# EAGLE design Esp32Relays (EAGLE 9.6.2)
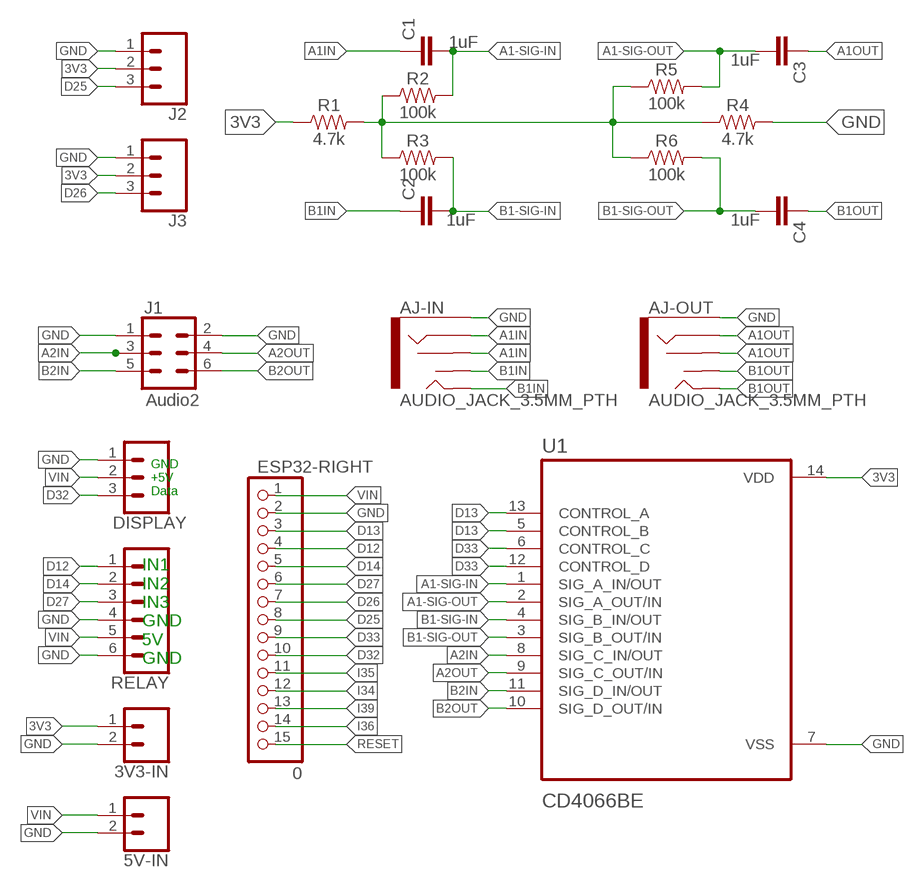
[diagram p0: schematic, sheet 1]

## Parts
3V3-IN  CONN_02  [1X02]
5V-IN  CONN_02  [1X02]
AJ-IN  AUDIO_JACK_3.5MM_PTH  [AUDIO-JACK]
AJ-OUT  AUDIO_JACK_3.5MM_PTH  [AUDIO-JACK]
C1  1uF  2.2UF-0805-25V-(+80/-20%)  [0805]
C2  1uF  2.2UF-0805-25V-(+80/-20%)  [0805]
C3  1uF  2.2UF-0805-25V-(+80/-20%)  [0805]
C4  1uF  2.2UF-0805-25V-(+80/-20%)  [0805]
DISPLAY  CONN_03  [1X03]
ESP32-RIGHT  0  PINHD-1X15  [1X15]
J1  Audio2  CONN_03X2FEMALE  [2X3]
J2  CONN_03  [1X03]
J3  CONN_03  [1X03]
R1  4.7k  0.3OHM-0805-1/8W-1%  [0805]
R2  100k  0.3OHM-0805-1/8W-1%  [0805]
R3  100k  0.3OHM-0805-1/8W-1%  [0805]
R4  4.7k  0.3OHM-0805-1/8W-1%  [0805]
R5  100k  0.3OHM-0805-1/8W-1%  [0805]
R6  100k  0.3OHM-0805-1/8W-1%  [0805]
RELAY  CONN_06NO_SILK_FEMALE_PTH  [1X06_NO_SILK]
U1  CD4066BE  [DIP794W45P254L1969H508Q14]

## Nets
3V3: 3V3-IN.1 J2.2 J3.2 R1.1 U1.14(VDD)
A1-SIG-IN: C1.2 R2.2 U1.1(SIG_A_IN/OUT)
A1-SIG-OUT: C3.2 R5.2 U1.2(SIG_A_OUT/IN)
A1IN: AJ-IN.RING AJ-IN.RSH C1.1
A1OUT: AJ-OUT.RING AJ-OUT.RSH C3.1
A2IN: J1.3 U1.8(SIG_C_IN/OUT)
A2OUT: J1.4 U1.9(SIG_C_OUT/IN)
B1-SIG-IN: C2.2 R3.2 U1.4(SIG_B_IN/OUT)
B1-SIG-OUT: C4.2 R6.2 U1.3(SIG_B_OUT/IN)
B1IN: AJ-IN.TIP AJ-IN.TSH C2.1
B1OUT: AJ-OUT.TIP AJ-OUT.TSH C4.1
B2IN: J1.5 U1.11(SIG_D_IN/OUT)
B2OUT: J1.6 U1.10(SIG_D_OUT/IN)
D12: ESP32-RIGHT.4 RELAY.1
D13: ESP32-RIGHT.3 U1.5(CONTROL_B) U1.13(CONTROL_A)
D14: ESP32-RIGHT.5 RELAY.2
D25: ESP32-RIGHT.8 J2.3
D26: ESP32-RIGHT.7 J3.3
D27: ESP32-RIGHT.6 RELAY.3
D32: DISPLAY.3 ESP32-RIGHT.10
D33: ESP32-RIGHT.9 U1.6(CONTROL_C) U1.12(CONTROL_D)
GND [POWER]: 3V3-IN.2 5V-IN.2 AJ-IN.SLEEVE AJ-OUT.SLEEVE DISPLAY.1 ESP32-RIGHT.2 J1.1 J1.2 J2.1 J3.1 R4.2 RELAY.4 RELAY.6 U1.7(VSS)
I34: ESP32-RIGHT.12
I35: ESP32-RIGHT.11
I36: ESP32-RIGHT.14
I39: ESP32-RIGHT.13
N$2: R1.2 R2.1 R3.1 R4.1 R5.1 R6.1
RESET: ESP32-RIGHT.15
VIN [POWER]: 5V-IN.1 DISPLAY.2 ESP32-RIGHT.1 RELAY.5

## Notes on the sheet
- GND
  +5V
  Data
- IN1
  IN2
  IN3
  GND
  5V
  GND

## Library data of the parts
3V3-IN 5V-IN = SparkFun-Connectors:CONN_02: Multi connection point. Often used as Generic Header-pin footprint for 0.1 inch spaced/style header connections On any of the 0.1 inch spaced packages, you can populate with these: Break Away Headers - Straight <https://www.sparkfun.com/products/116> (PRT-00116) Break Away Male Headers - Right Angle <https://www.sparkfun.com/products/553> (PRT-00553) Female Headers <https://www.sparkfun.com/products/115> (PRT-00115) Break Away Headers - Machine Pin <https://www.sparkfun.com/products/117> (PRT-00117) Break Away Female Headers - Swiss Machine Pin <https://www.sparkfun.com/products/743> (PRT-00743) For SCREWTERMINALS and SPRING TERMINALS visit here: Screw Terimnals on SparkFun.com <https://www.sparkfun.com/search/results?term=Screw+Terminals> (5mm/3.5mm/2.54mm spacing) This device is also useful as a general connection point to wire up your design to another part of your project. Our various solder wires solder well into these plated through hole pads. Hook-Up Wire - Assortment (Stranded, 22 AWG) <https://www.sparkfun.com/products/11375> (PRT-11375) Hook-Up Wire - Assortment (Solid Core, 22 AWG) <https://www.sparkfun.com/products/11367> (PRT-11367) View the entire wire category on our website here <https://www.sparkfun.com/categories/141> Special notes: Molex polarized connector foot print use with: PRT-08233 with associated crimp pins and housings. 2.54_SCREWTERM for use with PRT-10571. 3.5mm Screw Terminal footprints for PRT-08084 5mm Screw Terminal footprints for use with PRT-08432
AJ-IN AJ-OUT = SparkFun-Connectors:AUDIO_JACK_3.5MM: Audio Jack 3.5mm variants of PTH and SMT stereo audio jack with bypass switches. SparkFun Products: SparkFun SparkPunk Sound Kit <[https://www.sparkfun.com/products/11177]> - PTH MP3 Trigger <https://www.sparkfun.com/products/13720> -3.5mm SMD SparkFun PicoBoard <https://www.sparkfun.com/products/11888>- 2.5mm SMD; PROD_ID: CONN-08774; SF_ID: PRT-08032
C1-C4 = SparkFun-Capacitors:2.2UF: 2.2µF ceramic capacitors A capacitor is a passive two-terminal electrical component used to store electrical energy temporarily in an electric field.; PROD_ID: CAP-11624; VALUE: 2.2uF
DISPLAY J2 J3 = SparkFun-Connectors:CONN_03: Multi connection point. Often used as Generic Header-pin footprint for 0.1 inch spaced/style header connections On any of the 0.1 inch spaced packages, you can populate with these: Break Away Headers - Straight <https://www.sparkfun.com/products/116> (PRT-00116) Break Away Male Headers - Right Angle <https://www.sparkfun.com/products/553> (PRT-00553) Female Headers <https://www.sparkfun.com/products/115> (PRT-00115) Break Away Headers - Machine Pin <https://www.sparkfun.com/products/117> (PRT-00117) Break Away Female Headers - Swiss Machine Pin <https://www.sparkfun.com/products/743> (PRT-00743) Stackable Header - 3 Pin (Female, 0.1") <https://www.sparkfun.com/products/13875> (PRT-13875) For SCREWTERMINALS and SPRING TERMINALS visit here: Screw Terimnals on SparkFun.com <https://www.sparkfun.com/search/results?term=Screw+Terminals> (5mm/3.5mm/2.54mm spacing) This device is also useful as a general connection point to wire up your design to another part of your project. Our various solder wires solder well into these plated through hole pads. Hook-Up Wire - Assortment (Stranded, 22 AWG) <https://www.sparkfun.com/products/11375> (PRT-11375) Hook-Up Wire - Assortment (Solid Core, 22 AWG) <https://www.sparkfun.com/products/11367> (PRT-11367) View the entire wire category on our website here <https://www.sparkfun.com/categories/141> Special notes: Molex polarized connector foot print use with SKU : PRT-08232 with associated crimp pins and housings.
ESP32-RIGHT = pinhead:PINHD-1X15: PIN HEADER
J1 = SparkFun-Connectors:CONN_03X2: Multi connection point. Often used as Generic Header-pin footprint for 0.1 inch spaced/style header connections You can populate with any combo of single row headers, but if you'd like an exact match, check these: Header - 2x3 (Male, 0.1") <https://www.sparkfun.com/products/12807> (PRT-12807) Header - 2x3 (Female, 0.1") <https://www.sparkfun.com/products/13010> (PRT-13010) 2x3 Pin Shrouded Header <https://www.sparkfun.com/products/10877> (PRT-10877) On any of the 0.1 inch spaced packages, you can populate with these: Break Away Headers - Straight <https://www.sparkfun.com/products/116> (PRT-00116) Break Away Male Headers - Right Angle <https://www.sparkfun.com/products/553> (PRT-00553) Female Headers <https://www.sparkfun.com/products/115> (PRT-00115) Break Away Headers - Machine Pin <https://www.sparkfun.com/products/117> (PRT-00117) Break Away Female Headers - Swiss Machine Pin <https://www.sparkfun.com/products/743> (PRT-00743) Special note: the shrouded connector mates well with our 3x2 ribbon cables: Ribbon Crimp Connector - 6-pin (2x3, Female) <https://www.sparkfun.com/products/10651> (PRT-10651) Ribbon Cable - 6 wire (15ft) <https://www.sparkfun.com/products/10646> (PRT-10646); PROD_ID: CONN-11566; VALUE: FEMALE 2x3
R1-R6 = SparkFun-Resistors:0.3OHM: 0.3Ω resistor A resistor is a passive two-terminal electrical component that implements electrical resistance as a circuit element. Resistors act to reduce current flow, and, at the same time, act to lower voltage levels within circuits. - Wikipedia; PROD_ID: RES-11622; VALUE: 0.3
RELAY = SparkFun-Connectors:CONN_06: Multi connection point. Often used as Generic Header-pin footprint for 0.1 inch spaced/style header connections On any of the 0.1 inch spaced packages, you can populate with these: Break Away Headers - Straight <https://www.sparkfun.com/products/116> (PRT-00116) Break Away Male Headers - Right Angle <https://www.sparkfun.com/products/553> (PRT-00553) Female Headers <https://www.sparkfun.com/products/115> (PRT-00115) Break Away Headers - Machine Pin <https://www.sparkfun.com/products/117> (PRT-00117) Break Away Female Headers - Swiss Machine Pin <https://www.sparkfun.com/products/743> (PRT-00743) Arduino Stackable Header - 6 Pin <https://www.sparkfun.com/products/9280> (PRT-09280) For SCREWTERMINALS and SPRING TERMINALS visit here: Screw Terimnals on SparkFun.com <https://www.sparkfun.com/search/results?term=Screw+Terminals> (5mm/3.5mm/2.54mm spacing) This device is also useful as a general connection point to wire up your design to another part of your project. Our various solder wires solder well into these plated through hole pads. Hook-Up Wire - Assortment (Stranded, 22 AWG) <https://www.sparkfun.com/products/11375> (PRT-11375) Hook-Up Wire - Assortment (Solid Core, 22 AWG) <https://www.sparkfun.com/products/11367> (PRT-11367) View the entire wire category on our website here <https://www.sparkfun.com/categories/141>; PROD_ID: CONN-08437
U1 = CD4066BE:CD4066BE: Check availability <https://pricing.snapeda.com/parts/CD4066BE/Texas%20Instruments/view-part?ref=eda>; AVAILABILITY: In Stock; DESCRIPTION: 10-pA on-state leakage current, 20-V, 1:1 (SPST), 4-channel analog switch; MF: Texas Instruments; MP: CD4066BE; PACKAGE: PDIP-14 Texas Instruments; PRICE: None; PURCHASE-URL: https://pricing.snapeda.com/search/part/CD4066BE/?ref=eda

## Net classes
1 POWER: width 0.3 mm

## Board
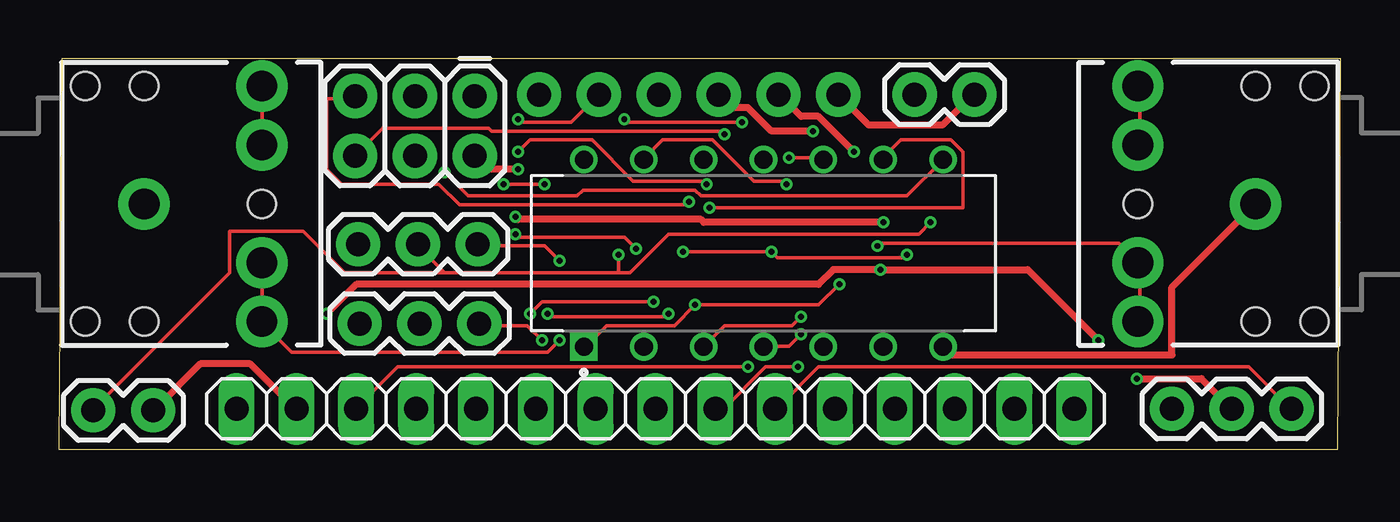
[diagram p1: board, top side]
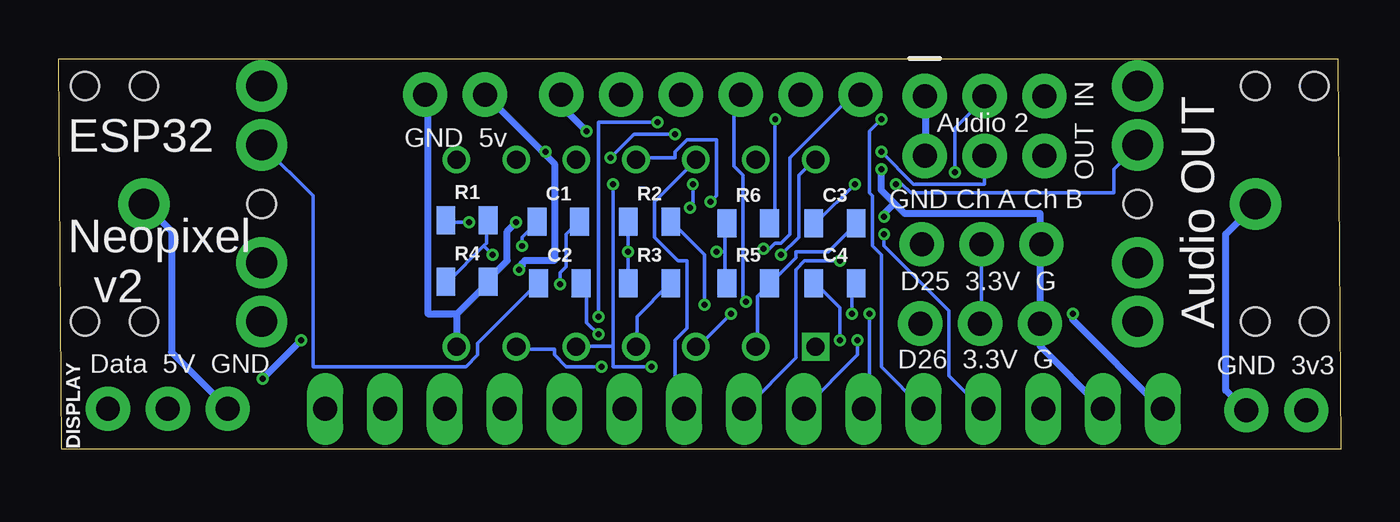
[diagram p2: board, bottom side, seen from below]

Size 54.41 x 16.56 mm. Coordinates in mm from the lower left corner, seen from the top.
Outline: 0,0 54.28,0 54.41,16.56 0.13,16.56 0,0
Copper layers (1*16): Top 0.035559375mm / dielectric 1.6mm / Bottom 0.035559375mm
Design rules "oshpark-2layer": minimum track width 6mil, minimum drill 10mil, track to track 6mil, track to pad 6mil, pad to pad 6mil, via to via 6mil, smd to smd 6mil, copper to edge 15mil, drill to drill 6mil, minimum pad ring 5mil, minimum via ring 5mil, stop-mask expansion 2.5mil, vias tented up to drill 0mil, thermal gap 10mil

### Footprints (pad centres in the part's own frame; a part is rotated, then mirrored left to right if it is on the bottom)
1X02 = drill 1.016 pad 1.88: 1 0,0; 2 2.54,0
AUDIO-JACK = drill 1.3 pad 2.184: RING 5,5; RSH 5,2.5; SLEEVE 0,0; TIP 5,-5; TSH 5,-2.5 | hole 1.2: 0,5; -2.5,5; -2.5,-5; 0,-5; 5,0
0805 = smd 0.8 x 1.2: 1 -0.9,0; 2 0.9,0
1X03 = drill 1.016 pad 1.88: 1 0,0; 2 2.54,0; 3 5.08,0
1X15 = drill 1.016 long: 1 -17.78,0; 2 -15.24,0; 3 -12.7,0; 4 -10.16,0; 5 -7.62,0; 6 -5.08,0; 7 -2.54,0; 8 0,0; 9 2.54,0; 10 5.08,0; 11 7.62,0; 12 10.16,0; 13 12.7,0; 14 15.24,0; 15 17.78,0
2X3 = drill 1.016 pad 1.88: 1 0,0; 2 0,2.54; 3 2.54,0; 4 2.54,2.54; 5 5.08,0; 6 5.08,2.54
1X06_NO_SILK = drill 1.016 pad 1.88: 1 0,0; 2 2.54,0; 3 5.08,0; 4 7.62,0; 5 10.16,0; 6 12.7,0
DIP794W45P254L1969H508Q14 = drill 0.77 pad 1.17 square: 1 -3.97,7.62 | drill 0.77 pad 1.17: 2 -3.97,5.08; 3 -3.97,2.54; 4 -3.97,0; 5 -3.97,-2.54; 6 -3.97,-5.08; 7 -3.97,-7.62; 8 3.97,-7.62; 9 3.97,-5.08; 10 3.97,-2.54; 11 3.97,0; 12 3.97,2.54; 13 3.97,5.08; 14 3.97,7.62

### Placement (x,y rotation side)
3V3-IN  1.46,1.65 0 top
5V-IN  36.32,15.05 0 top
AJ-IN  50.8,10.41 180 top
AJ-OUT  3.62,10.41 0 top
C1  33.21,9.65 0 bottom
C2  33.15,7.05 0 bottom
C3  21.46,9.59 0 bottom
C4  21.46,7.05 0 bottom
DISPLAY  47.24,1.71 0 top
ESP32-RIGHT  25.32,1.71 0 top
J1  17.65,14.99 180 top
J2  12.7,8.7 0 top
J3  12.76,5.33 0 top
R1  37.08,9.72 0 bottom
R2  29.34,9.65 0 bottom
R3  29.34,7.05 0 bottom
R4  37.08,7.11 0 bottom
R5  25.15,7.05 0 bottom
R6  25.15,9.59 0 bottom
RELAY  20.38,15.05 0 top
U1  29.91,8.32 90 top

### Tracks (layer width: path | path; a pad name or v marks a point on that pad's centre or on a via)
3V3  (via drill 0.25)
  Top 0.152: v37,9.62 36.5,9.12 25.88,9.12 24.25,7.5 23.75,7.5 | 16.38,7.5 23.75,7.5 | 16.38,7.5 15.25,8.62 J2.2 | 23.75,7.5 v23.75,8.25 | 16.38,7.5 12.12,7.5 10.38,9.25 7.25,9.25 7.25,7.5 1.5,1.75 3V3-IN.1
  Bottom 0.152: v37,9.62 37.88,9.62 R1.1 | v23.75,8.25 23,9 23,11.62 22.38,12.25 U1.14 | J3.2 15.25,5.38 15.25,8.62 J2.2
A1-SIG-IN  (via drill 0.25)
  Top 0.152: U1.1 22.38,4.38 23.25,5.25 26.12,5.25 v27,6.12 32.25,6.12 v33.12,7
  Bottom 0.152: v27,6.12 27,8.25 28.38,9.62 R2.2 | v33.12,7 33.12,7.5 32.88,7.75 32.88,9.12 32.38,9.62 C1.2
A1-SIG-OUT
  Bottom 0.152: U1.2 24.75,4.38 24.75,6.5 24.25,7 R5.2 24.12,7.12 23.12,8.12 23.12,8.38 21.75,8.38 20.62,9.5 C3.2
A1IN  (via drill 0.25)
  Top 0.152: v34.75,8.62 34.88,8.75 45,8.75 45.75,8 AJ-IN.RSH 45.88,7.88 45.88,5.5 AJ-IN.RING
  Bottom 0.152: v34.75,8.62 34.75,9 34.12,9.62 C1.1
A1OUT  (via drill 0.25)
  Top 0.152: v18.88,11.25 v20.62,11.25 | AJ-OUT.RING 8.62,15.38 8.62,13 AJ-OUT.RSH
  Bottom 0.152: v20.62,11.25 22.25,9.62 C3.1 | v18.88,11.25 18.62,11.25 18.25,10.88 9.62,10.88 9.62,11.88 8.62,12.88 AJ-OUT.RSH
A2IN  (via drill 0.25)
  Top 0.152: v16.38,11.75 17.38,10.75 22,10.75 22.25,11 27,11 27.25,10.75 36,10.75 37.5,12.25 U1.8
  Bottom 0.152: v16.38,11.75 16.38,13.62 15.12,14.88 J1.3
A2OUT  (via drill 0.25)
  Top 0.152: v27.62,10.25 38.38,10.25 38.38,12.62 37.88,13.12 35.75,13.12 35,12.38 U1.9 | v27.5,11.25 27.38,11.38 24.38,11.38 22.62,13.12 20,13.12 v19.5,12.62
  Bottom 0.152: v27.62,10.25 27.5,10.38 v27.5,11.25 | v19.5,12.62 18.12,11.25 15.12,11.25 15.12,12.38 J1.4
B1-SIG-IN  (via drill 0.25)
  Top 0.152: v31.5,4.88 31,4.38 30,4.38 U1.4
  Bottom 0.152: R3.2 28.5,7 29.88,5.62 29.88,4.38 U1.4 | v31.5,4.88 32,5.38 32,6.88 32.12,7 C2.2
B1-SIG-OUT  (via drill 0.25)
  Top 0.152: v20.75,5.75 20.88,5.62 25.75,5.62 v25.88,5.75 | v24,14 24.12,13.88 v29,13.88 | v31.5,5.62 31.12,5.25 28.25,5.25 27.38,4.38 U1.3
  Bottom 0.152: v20.75,5.75 20.75,6.88 20.62,7 C4.2 | v25.88,5.75 27.25,4.38 U1.3 | v24,14 24,9.75 24.12,9.62 R6.2 | v29,13.88 31.5,13.88 v31.5,5.62
B1IN
  Top 0.152: AJ-IN.TIP 45.88,15.38 45.88,13 AJ-IN.TSH
  Bottom 0.152: C2.1 34.12,7 36.62,4.5 36.62,4 37.12,3.5 43.62,3.5 43.62,10.75 45.75,12.88 AJ-IN.TSH
B1OUT  (via drill 0.25)
  Top 0.152: v21.25,4.62 20.75,4.12 9.88,4.12 8.62,5.38 AJ-OUT.TIP 8.62,5.5 8.62,7.88 AJ-OUT.TSH
  Bottom 0.152: v21.25,4.62 21.25,6 22.25,7 C4.1
B2IN  (via drill 0.25)
  Top 0.152: v26.75,10.5 26.62,10.38 17,10.38 16.12,11.25 12,11.25 11.38,11.88 11.38,14.88 12.5,14.88 J1.5
  Bottom 0.152: v26.75,10.5 26.5,10.75 26.5,13.12 27.75,13.12 28.25,12.62 28.25,12.38 29.88,12.38 U1.11
B2OUT  (via drill 0.25)
  Top 0.152: v31,12.38 32.38,12.38 U1.10 | v28.25,13.38 28.12,13.5 18.38,13.5 18.25,13.62 13.75,13.62 12.62,12.5 J1.6
  Bottom 0.152: v31,12.38 30,13.38 v28.25,13.38
D12  (via drill 0.25)
  Top 0.152: v19.38,9.12 19.5,9 24,9 v24.5,8.5
  Bottom 0.152: v19.38,9.12 19.38,8.62 16.62,5.88 16.62,3.12 15.25,1.75 ESP32-RIGHT.4 | v24.5,8.5 24.25,8.5 24,8.75 23.75,8.75 23.38,9.12 23.38,12.38 20.75,15 20.5,15 RELAY.1
D13  (via drill 0.25)
  Top 0.152: v30.88,11.25 30.75,11.38 29.5,11.38 27.75,13.12 25.62,13.12 24.88,12.38 U1.13 | v29.25,3.5 14.38,3.5 12.62,1.75 ESP32-RIGHT.3
  Bottom 0.152: 30.88,4.38 32.38,4.38 U1.5 | v30.88,11.25 30.88,4.38 | v29.25,3.5 30.88,3.5 30.88,4.38
D14  (via drill 0.25)
  Top 0.152: v19.5,14 19.62,13.88 21.75,13.88 22.88,15 RELAY.2
  Bottom 0.152: v19.5,14 20,13.5 20,10.88 19.88,10.75 19.88,8.62 19.5,8.25 19.5,3.5 17.75,1.75 ESP32-RIGHT.5
D25  (via drill 0.25)
  Top 0.152: v21.25,8 20.62,8.62 17.88,8.62 J2.3
  Bottom 0.152: v21.25,8 22.75,8 23.12,7.62 23.12,3.88 25.25,1.75 ESP32-RIGHT.8
D26  (via drill 0.25)
  Top 0.152: v20.5,4.62 19.88,5.25 17.88,5.25 J3.3
  Bottom 0.152: v20.5,4.62 20.5,4 22.75,1.75 ESP32-RIGHT.7
D27  (via drill 0.25)
  Top 0.152: v20,5.75 20.5,6.25 v25.25,6.25
  Bottom 0.152: v20,5.75 20,1.88 20.12,1.75 ESP32-RIGHT.6 | v25.25,6.25 25.38,6.38 25.38,11.62 25.75,12 25.75,14.75 25.5,15 RELAY.3
D32
  Top 0.152: ESP32-RIGHT.10 30.5,1.75 32.25,3.5 50.5,3.5 52.25,1.75 DISPLAY.3
D33  (via drill 0.25)
  Top 0.152: v31.38,3.5 30,3.5 28.25,1.75 27.88,1.75 ESP32-RIGHT.9
  Bottom 0.152: U1.12 27.38,12.25 29.12,10.5 29.12,9 28.12,8 27.75,8 27.75,5.12 28.25,4.62 28.25,2.12 27.88,1.75 ESP32-RIGHT.9 | v31.38,3.5 32.88,3.5 33.38,4 33.38,4.25 34.88,4.25 U1.6
GND  (via drill 0.25)
  Top 0.3: 3V3-IN.2 4.12,1.75 6,3.62 8.12,3.62 10,1.75 ESP32-RIGHT.2 | v19.5,11.88 18.25,11.88 17.75,12.38 J1.2 | v32,13.5 30.25,13.5 29.25,14.5 28.62,14.5 28.12,15 RELAY.4 | RELAY.6 33.12,15 34.38,13.75 37.5,13.75 38.75,15 5V-IN.2 | AJ-IN.SLEEVE 50.75,10.38 47.25,6.88 47.25,4 37.88,4 37.62,4.25 U1.7 | v19.38,9.88 19.5,9.75 27.25,9.75 27.38,9.62 v35,9.62
  Bottom 0.3: J1.2 17.62,12.5 17.62,14.88 J1.1 | ESP32-RIGHT.2 10.12,1.75 12.75,4.38 12.75,5.25 J3.1 12.75,5.38 12.75,8.62 J2.1 12.75,8.75 12.75,10 18.5,10 18.94,10.44 | AJ-OUT.SLEEVE 3.62,10.38 4.88,9.12 4.88,2.5 4.12,1.75 3V3-IN.2 | v19.5,11.88 19.5,11 18.94,10.44 | DISPLAY.1 47.25,1.75 49.62,4.12 49.62,9.25 50.75,10.38 AJ-IN.SLEEVE | v32,13.5 33,14.5 33,15 RELAY.6 | 37.5,5.75 36.25,7 R4.2 36.12,7.25 35.38,8 35.38,9.25 v35,9.62 | 37.5,5.75 37.5,4.38 U1.7 | 37.5,5.75 38.75,5.75 38.75,15 5V-IN.2 | 18.94,10.44 19.38,10 v19.38,9.88
N$2  (via drill 0.25)
  Top 0.152: v26.5,8.38 v30.25,8.38 30.5,8.12 35.88,8.12 v36,8.25
  Bottom 0.152: 36.38,8.62 36.25,8.75 36.25,9.62 R1.2 | 36.38,8.62 37.88,7.12 R4.1 | 26.12,8.38 26.12,9.5 R6.1 | 26.12,8.38 26.12,7.12 R5.1 | R3.1 30.25,7.12 v30.25,8.38 30.25,9.62 R2.1 | v26.5,8.38 26.12,8.38 | v36,8.25 36.38,8.62
VIN  (via drill 0.25)
  Top 0.3: v11.38,5.75 12.62,7 32.25,7 32.88,7.62 v34.88,7.62 41.12,7.62 v44.12,4.62 | v33.75,12.62 32.25,14.12 31.5,14.12 30.62,15 RELAY.5 | v45.75,3 48.5,3 49.75,1.75 DISPLAY.2
  Bottom 0.3: v11.38,5.75 11.38,5.5 7.62,1.75 ESP32-RIGHT.1 | v34.88,7.62 34.75,7.75 34.75,7.88 34.62,8 33.38,8 33.38,12.12 33.81,12.56 | 33.81,12.56 36.25,15 5V-IN.1 | v33.75,12.62 33.81,12.56 | v44.12,4.62 v45.75,3

### Text on the board
bPlace: OUT IN | Audio OUT | Audio 2 | GND 5v | GND Ch A Ch B | D25 3.3V G | ESP32 / / Neopixel / v2 | GND 3v3 | D26 3.3V G | Data 5V GND